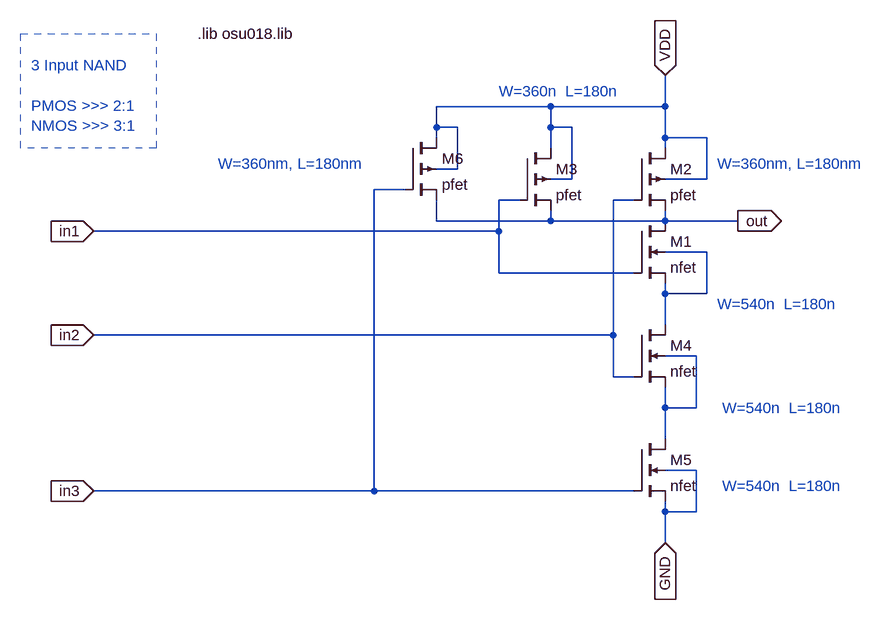
[diagram p0: schematic nand301.asc]
nand301.asc, the LTspice schematic file:
Version 4
SHEET 1 916 896
WIRE 96 0 -80 0
WIRE 272 0 272 -48
WIRE 272 0 96 0
WIRE -80 32 -80 0
WIRE -48 32 -80 32
WIRE 96 32 96 0
WIRE 128 32 96 32
WIRE -80 48 -80 32
WIRE 272 48 272 0
WIRE 336 48 272 48
WIRE 96 64 96 32
WIRE 272 64 272 48
WIRE -48 96 -48 32
WIRE -48 96 -80 96
WIRE 128 112 128 32
WIRE 128 112 96 112
WIRE 336 112 336 48
WIRE 336 112 272 112
WIRE -128 128 -176 128
WIRE 48 144 16 144
WIRE 224 144 192 144
WIRE -80 176 -80 144
WIRE 96 176 96 160
WIRE 96 176 -80 176
WIRE 272 176 272 160
WIRE 272 176 96 176
WIRE 384 176 272 176
WIRE 16 192 16 144
WIRE 16 192 -608 192
WIRE 336 224 272 224
WIRE 16 256 16 192
WIRE 224 256 16 256
WIRE 272 288 272 272
WIRE 336 288 336 224
WIRE 336 288 272 288
WIRE 272 336 272 288
WIRE 192 352 192 144
WIRE 192 352 -608 352
WIRE 320 384 272 384
WIRE 192 416 192 352
WIRE 224 416 192 416
WIRE 272 464 272 432
WIRE 320 464 320 384
WIRE 320 464 272 464
WIRE 272 512 272 464
WIRE 320 560 272 560
WIRE -176 592 -176 128
WIRE -176 592 -608 592
WIRE 224 592 -176 592
WIRE 272 624 272 608
WIRE 320 624 320 560
WIRE 320 624 272 624
WIRE 272 672 272 624
FLAG 384 176 out
IOPIN 384 176 Out
FLAG -608 192 in1
IOPIN -608 192 In
FLAG 272 -48 VDD
IOPIN 272 -48 In
FLAG 272 672 GND
IOPIN 272 672 In
FLAG -608 352 in2
IOPIN -608 352 In
FLAG -608 592 in3
IOPIN -608 592 In
SYMBOL nmos4 224 176 R0
SYMATTR InstName M1
SYMATTR Value2 l=180n w=540n
SYMATTR Value nfet
SYMBOL pmos4 224 64 R0
SYMATTR InstName M2
SYMATTR Value2 l=180n w=360n
SYMATTR Value pfet
SYMBOL pmos4 48 64 R0
SYMATTR InstName M3
SYMATTR Value pfet
SYMATTR Value2 l=180n w=360n
SYMBOL nmos4 224 336 R0
SYMATTR InstName M4
SYMATTR Value nfet
SYMATTR Value2 l=180n w=540n
SYMBOL nmos4 224 512 R0
SYMATTR InstName M5
SYMATTR Value nfet
SYMATTR Value2 l=180n w=540n
SYMBOL pmos4 -128 48 R0
SYMATTR InstName M6
SYMATTR Value pfet
SYMATTR Value2 l=180n w=360n
TEXT -448 -112 Left 2 !.lib osu018.lib
TEXT 352 304 Left 2 ;W=540n  L=180n
TEXT 352 88 Left 2 ;W=360nm, L=180nm
TEXT 360 464 Left 2 ;W=540n  L=180n
TEXT -416 88 Left 2 ;W=360nm, L=180nm
TEXT 360 584 Left 2 ;W=540n  L=180n
TEXT 16 -24 Left 2 ;W=360n  L=180n
TEXT -704 -64 Left 2 ;3 Input NAND\n \nPMOS >>> 2:1\nNMOS >>> 3:1
RECTANGLE Normal -512 64 -720 -112 2

The netlist it stands for:
* nand301.asc
M1 out in1 N001 N001 nfet l=180n w=540n
M2 VDD in2 out VDD pfet l=180n w=360n
M3 VDD in1 out VDD pfet l=180n w=360n
M4 N001 in2 N002 N002 nfet l=180n w=540n
M5 N002 in3 GND GND nfet l=180n w=540n
M6 VDD in3 out VDD pfet l=180n w=360n
.model NMOS NMOS
.model PMOS PMOS
.lib standard.mos
.lib osu018.lib
* W=540n  L=180n
* W=360nm, L=180nm
* W=540n  L=180n
* W=360nm, L=180nm
* W=540n  L=180n
* W=360n  L=180n
* 3 Input NAND
* PMOS >>> 2:1
* NMOS >>> 3:1
.backanno
.end